# Altium schematic sheet 4_Accelerometer.SchDoc
size A4; SheetNumber: 5; SheetTotal: 6
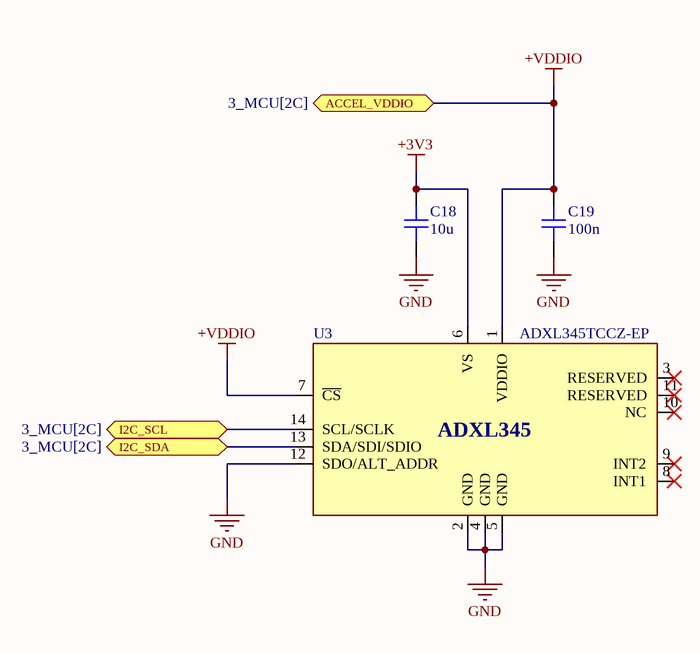
[diagram p0: 4_Accelerometer.SchDoc]

## Parts
C18  10u  [CAP_0402]
C19  100n  [CAP_0402]
U3  ADXL345TCCZ-EP  [LGA_CC-14-1_ADI]

## Ports
ACCEL_VDDIO (bidir, see 3_MCU[2C]), I2C_SCL (bidir, see 3_MCU[2C]), I2C_SDA (bidir, see 3_MCU[2C])

## Nets
+3V3: C18.2 U3.6(VS)
+VDDIO: C19.2 U3.1(VDDIO) U3.7(~{CS}) ; port ACCEL_VDDIO
GND: C18.1 C19.1 U3.2(GND) U3.4(GND) U3.5(GND) U3.12(SDO/ALT_ADDR)
I2C_SCL: U3.14(SCL/SCLK) ; port I2C_SCL
I2C_SDA: U3.13(SDA/SDI/SDIO) ; port I2C_SDA

Not connected (* = marked no-connect by the designer): U3 3(RESERVED)* 8(INT1)* 9(INT2)* 10(NC)* 11(RESERVED)*

## Notes on the sheet
- (in symbol ADXL345TCCZ-EP) ADXL345

## Library data of the parts
C18 = CAP_0402_10V: Capacitor SMD 0402 10V; Supplier 1: Arrow Electronics; Supplier Part Number 1: GRM155R61A106ME11D
C19 = CAP_0402_16V: Capacitor SMD 0402 16V; Supplier 1: Mouser; Supplier Part Number 1: 187-CL05A104KP5NNND
U3 = ADXL345TCCZ-EP: 3-Axis, ±2 g/±4 g/±8 g/±16 g Digital Accelerometer Extended Performance SPI/I2C; Manufacturer: Analog Devices; Manufacturer Part Number: ADXL345TCCZ-EP; Supplier 1: Mouser; Supplier Part Number 1: 584-ADXL345TCCZ-EP